# Altium project 8-8_控制板.PrjPCB
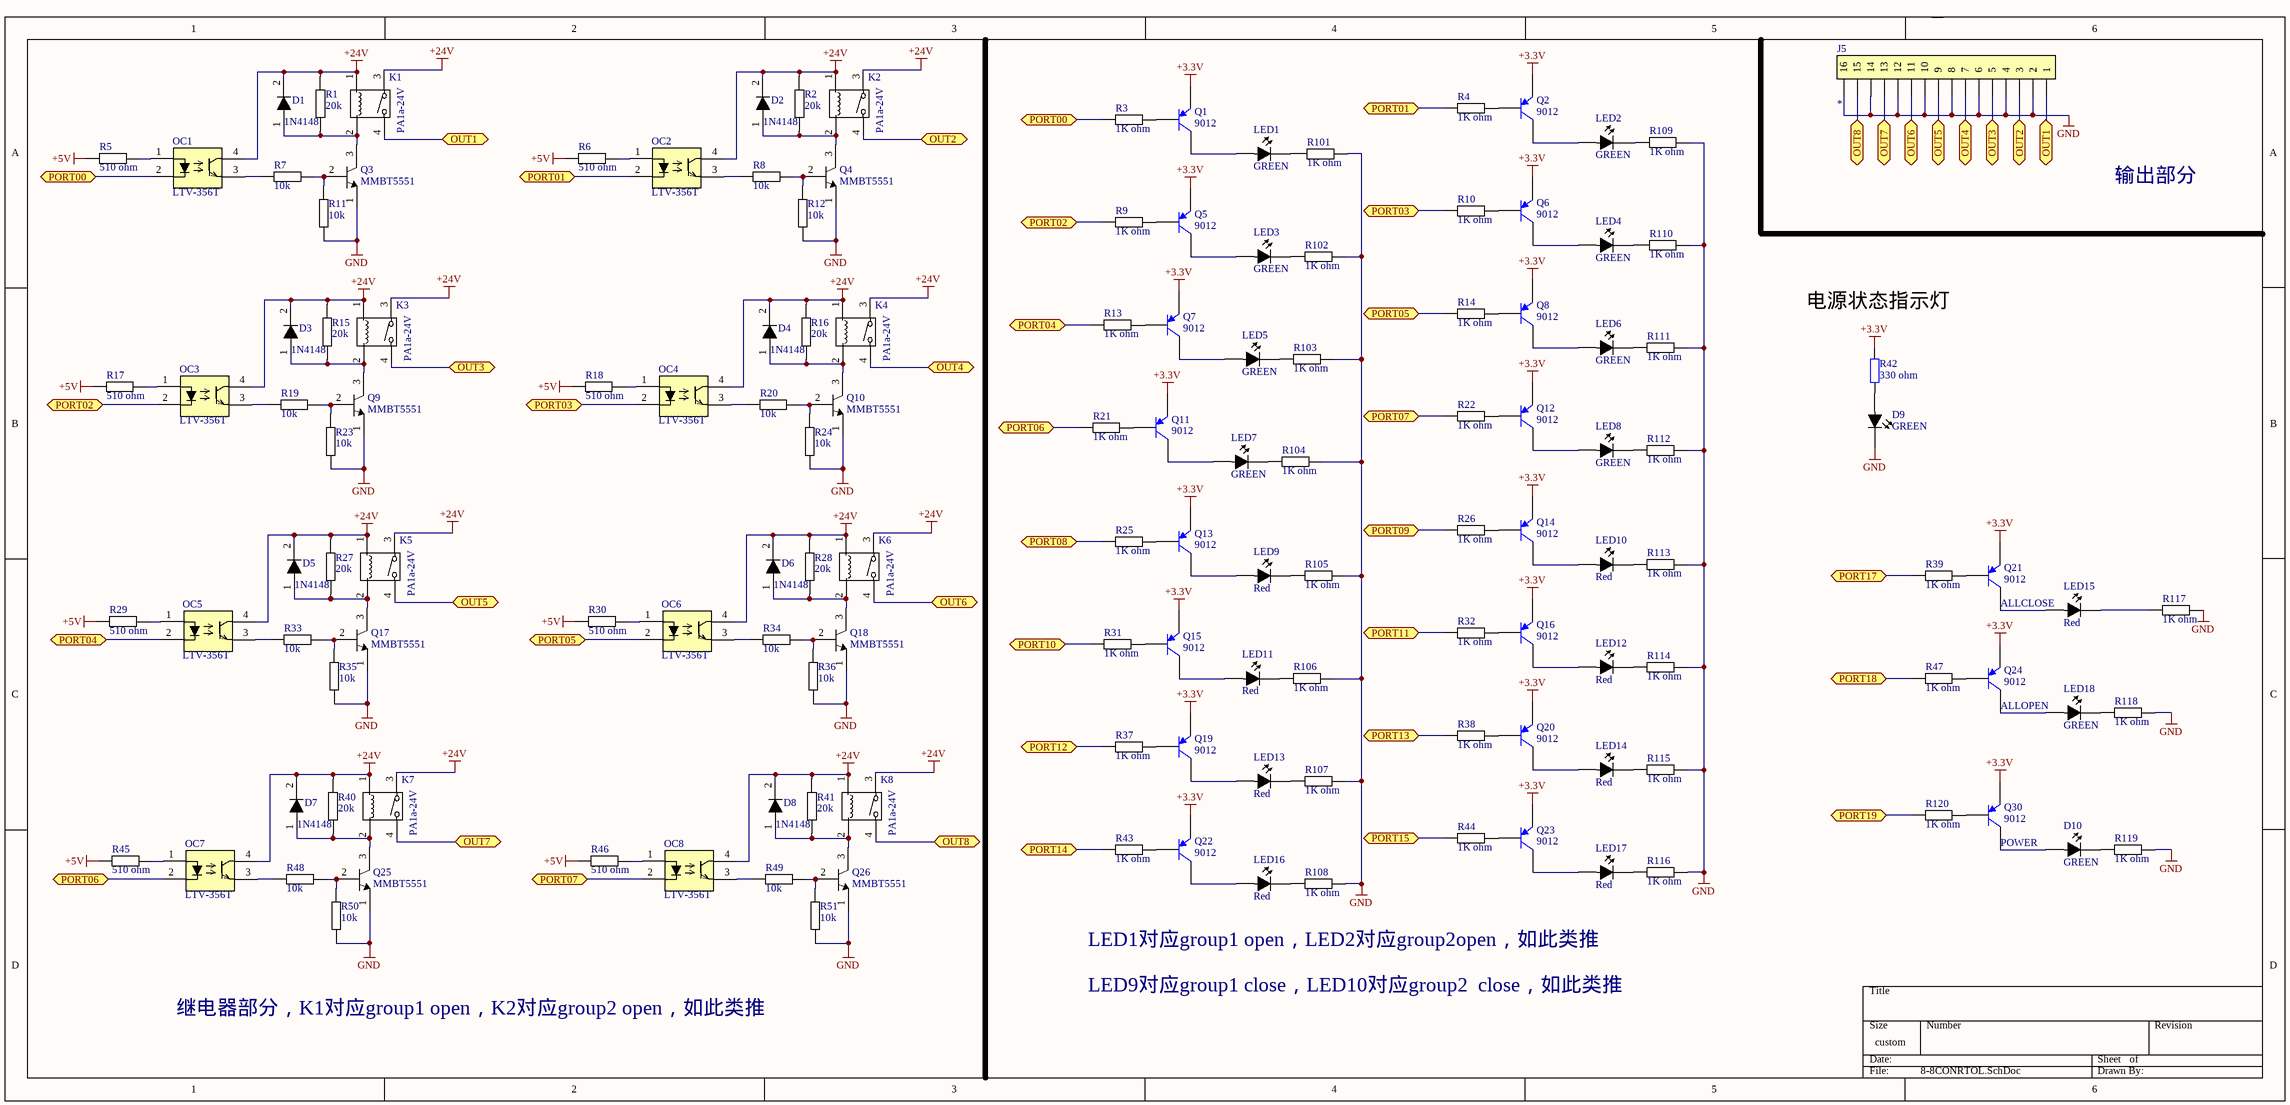
[diagram p0: 8-8CONRTOL.SchDoc]
2 sheets, 240 parts. Net scope: flat (ports and power ports of the same name join across sheets).
Board file: 8-8控制板.PcbDoc
Sheets:
  8-8CONRTOL.SchDoc
  8-8main.SchDoc

## Sheet 8-8CONRTOL.SchDoc
size 508 x 241 mm

### Parts
D1  1N4148  [D 1N4148(SOD-80/LL-34)]
D2  1N4148  [D 1N4148(SOD-80/LL-34)]
D3  1N4148  [D 1N4148(SOD-80/LL-34)]
D4  1N4148  [D 1N4148(SOD-80/LL-34)]
D5  1N4148  [D 1N4148(SOD-80/LL-34)]
D6  1N4148  [D 1N4148(SOD-80/LL-34)]
D7  1N4148  [D 1N4148(SOD-80/LL-34)]
D8  1N4148  [D 1N4148(SOD-80/LL-34)]
D9  GREEN  [0805 D]
D10  GREEN  [LED 3mm SIP]
J5  Header 1*16  [TIMECON5.1MMA]  (value not drawn)
K1  PA1a-24V  [Relay PA1a-24V]
K2  PA1a-24V  [Relay PA1a-24V]
K3  PA1a-24V  [Relay PA1a-24V]
K4  PA1a-24V  [Relay PA1a-24V]
K5  PA1a-24V  [Relay PA1a-24V]
K6  PA1a-24V  [Relay PA1a-24V]
K7  PA1a-24V  [Relay PA1a-24V]
K8  PA1a-24V  [Relay PA1a-24V]
LED1  GREEN  [LED 3mm SIP]
LED2  GREEN  [LED 3mm SIP]
LED3  GREEN  [LED 3mm SIP]
LED4  GREEN  [LED 3mm SIP]
LED5  GREEN  [LED 3mm SIP]
LED6  GREEN  [LED 3mm SIP]
LED7  GREEN  [LED 3mm SIP]
LED8  GREEN  [LED 3mm SIP]
LED9  Red  [LED 3mm SIP]
LED10  Red  [LED 3mm SIP]
LED11  Red  [LED 3mm SIP]
LED12  Red  [LED 3mm SIP]
LED13  Red  [LED 3mm SIP]
LED14  Red  [LED 3mm SIP]
LED15  Red  [LED 3mm SIP]
LED16  Red  [LED 3mm SIP]
LED17  Red  [LED 3mm SIP]
LED18  GREEN  [LED 3mm SIP]
OC1  LTV-356T  [SOP-4 LTV356T]
OC2  LTV-356T  [SOP-4 LTV356T]
OC3  LTV-356T  [SOP-4 LTV356T]
OC4  LTV-356T  [SOP-4 LTV356T]
OC5  LTV-356T  [SOP-4 LTV356T]
OC6  LTV-356T  [SOP-4 LTV356T]
OC7  LTV-356T  [SOP-4 LTV356T]
OC8  LTV-356T  [SOP-4 LTV356T]
Q1  9012  [9012  SOT-23/TO-236)]
Q2  9012  [9012  SOT-23/TO-236)]
Q3  MMBT5551  [MMBT5551(SOT-23/TO-236)]
Q4  MMBT5551  [MMBT5551(SOT-23/TO-236)]
Q5  9012  [9012  SOT-23/TO-236)]
Q6  9012  [9012  SOT-23/TO-236)]
Q7  9012  [9012  SOT-23/TO-236)]
Q8  9012  [9012  SOT-23/TO-236)]
Q9  MMBT5551  [MMBT5551(SOT-23/TO-236)]
Q10  MMBT5551  [MMBT5551(SOT-23/TO-236)]
Q11  9012  [9012  SOT-23/TO-236)]
Q12  9012  [9012  SOT-23/TO-236)]
Q13  9012  [9012  SOT-23/TO-236)]
Q14  9012  [9012  SOT-23/TO-236)]
Q15  9012  [9012  SOT-23/TO-236)]
Q16  9012  [9012  SOT-23/TO-236)]
Q17  MMBT5551  [MMBT5551(SOT-23/TO-236)]
Q18  MMBT5551  [MMBT5551(SOT-23/TO-236)]
Q19  9012  [9012  SOT-23/TO-236)]
Q20  9012  [9012  SOT-23/TO-236)]
Q21  9012  [9012  SOT-23/TO-236)]
Q22  9012  [9012  SOT-23/TO-236)]
Q23  9012  [9012  SOT-23/TO-236)]
Q24  9012  [9012  SOT-23/TO-236)]
Q25  MMBT5551  [MMBT5551(SOT-23/TO-236)]
Q26  MMBT5551  [MMBT5551(SOT-23/TO-236)]
Q30  9012  [9012  SOT-23/TO-236)]
R1  value 20k  [0805 R 1/8W]  (hidden comment: RES)
R2  value 20k  [0805 R 1/8W]  (hidden comment: RES)
R3  value 1K ohm  [0805 R 1/8W]  (hidden comment: RES)
R4  value 1K ohm  [0805 R 1/8W]  (hidden comment: RES)
R5  value 510 ohm  [0805 R 1/8W]  (hidden comment: RES)
R6  value 510 ohm  [0805 R 1/8W]  (hidden comment: RES)
R7  value 10k  [0805 R 1/8W]  (hidden comment: RES)
R8  value 10k  [0805 R 1/8W]  (hidden comment: RES)
R9  value 1K ohm  [0805 R 1/8W]  (hidden comment: RES)
R10  value 1K ohm  [0805 R 1/8W]  (hidden comment: RES)
R11  value 10k  [0805 R 1/8W]  (hidden comment: RES)
R12  value 10k  [0805 R 1/8W]  (hidden comment: RES)
R13  value 1K ohm  [0805 R 1/8W]  (hidden comment: RES)
R14  value 1K ohm  [0805 R 1/8W]  (hidden comment: RES)
R15  value 20k  [0805 R 1/8W]  (hidden comment: RES)
R16  value 20k  [0805 R 1/8W]  (hidden comment: RES)
R17  value 510 ohm  [0805 R 1/8W]  (hidden comment: RES)
R18  value 510 ohm  [0805 R 1/8W]  (hidden comment: RES)
R19  value 10k  [0805 R 1/8W]  (hidden comment: RES)
R20  value 10k  [0805 R 1/8W]  (hidden comment: RES)
R21  value 1K ohm  [0805 R 1/8W]  (hidden comment: RES)
R22  value 1K ohm  [0805 R 1/8W]  (hidden comment: RES)
R23  value 10k  [0805 R 1/8W]  (hidden comment: RES)
R24  value 10k  [0805 R 1/8W]  (hidden comment: RES)
R25  value 1K ohm  [0805 R 1/8W]  (hidden comment: RES)
R26  value 1K ohm  [0805 R 1/8W]  (hidden comment: RES)
R27  value 20k  [0805 R 1/8W]  (hidden comment: RES)
R28  value 20k  [0805 R 1/8W]  (hidden comment: RES)
R29  value 510 ohm  [0805 R 1/8W]  (hidden comment: RES)
R30  value 510 ohm  [0805 R 1/8W]  (hidden comment: RES)
R31  value 1K ohm  [0805 R 1/8W]  (hidden comment: RES)
R32  value 1K ohm  [0805 R 1/8W]  (hidden comment: RES)
R33  value 10k  [0805 R 1/8W]  (hidden comment: RES)
R34  value 10k  [0805 R 1/8W]  (hidden comment: RES)
R35  value 10k  [0805 R 1/8W]  (hidden comment: RES)
R36  value 10k  [0805 R 1/8W]  (hidden comment: RES)
R37  value 1K ohm  [0805 R 1/8W]  (hidden comment: RES)
R38  value 1K ohm  [0805 R 1/8W]  (hidden comment: RES)
R39  value 1K ohm  [0805 R 1/8W]  (hidden comment: RES)
R40  value 20k  [0805 R 1/8W]  (hidden comment: RES)
R41  value 20k  [0805 R 1/8W]  (hidden comment: RES)
R42  330 ohm  [0805 D]
R43  value 1K ohm  [0805 R 1/8W]  (hidden comment: RES)
R44  value 1K ohm  [0805 R 1/8W]  (hidden comment: RES)
R45  value 510 ohm  [0805 R 1/8W]  (hidden comment: RES)
R46  value 510 ohm  [0805 R 1/8W]  (hidden comment: RES)
R47  value 1K ohm  [0805 R 1/8W]  (hidden comment: RES)
R48  value 10k  [0805 R 1/8W]  (hidden comment: RES)
R49  value 10k  [0805 R 1/8W]  (hidden comment: RES)
R50  value 10k  [0805 R 1/8W]  (hidden comment: RES)
R51  value 10k  [0805 R 1/8W]  (hidden comment: RES)
R101  value 1K ohm  [0805 R 1/8W]  (hidden comment: RES)
R102  value 1K ohm  [0805 R 1/8W]  (hidden comment: RES)
R103  value 1K ohm  [0805 R 1/8W]  (hidden comment: RES)
R104  value 1K ohm  [0805 R 1/8W]  (hidden comment: RES)
R105  value 1K ohm  [0805 R 1/8W]  (hidden comment: RES)
R106  value 1K ohm  [0805 R 1/8W]  (hidden comment: RES)
R107  value 1K ohm  [0805 R 1/8W]  (hidden comment: RES)
R108  value 1K ohm  [0805 R 1/8W]  (hidden comment: RES)
R109  value 1K ohm  [0805 R 1/8W]  (hidden comment: RES)
R110  value 1K ohm  [0805 R 1/8W]  (hidden comment: RES)
R111  value 1K ohm  [0805 R 1/8W]  (hidden comment: RES)
R112  value 1K ohm  [0805 R 1/8W]  (hidden comment: RES)
R113  value 1K ohm  [0805 R 1/8W]  (hidden comment: RES)
R114  value 1K ohm  [0805 R 1/8W]  (hidden comment: RES)
R115  value 1K ohm  [0805 R 1/8W]  (hidden comment: RES)
R116  value 1K ohm  [0805 R 1/8W]  (hidden comment: RES)
R117  value 1K ohm  [0805 R 1/8W]  (hidden comment: RES)
R118  value 1K ohm  [0805 R 1/8W]  (hidden comment: RES)
R119  value 1K ohm  [0805 R 1/8W]  (hidden comment: RES)
R120  value 1K ohm  [0805 R 1/8W]  (hidden comment: RES)

### Ports
OUT1 (bidir), OUT2 (bidir), OUT3 (bidir), OUT4 (bidir), OUT5 (bidir), OUT6 (bidir), OUT7 (bidir), OUT8 (bidir), PORT00 (bidir), PORT01 (bidir), PORT02 (bidir), PORT03 (bidir), PORT04 (bidir), PORT05 (bidir), PORT06 (bidir), PORT07 (bidir), PORT08 (bidir), PORT09 (bidir), PORT10 (bidir), PORT11 (bidir), PORT12 (bidir), PORT13 (bidir), PORT14 (bidir), PORT15 (bidir), PORT17 (bidir), PORT18 (bidir), PORT19 (bidir)

### Nets
+3.3V: Q1.2(E) Q2.2(E) Q5.2(E) Q6.2(E) Q7.2(E) Q8.2(E) Q11.2(E) Q12.2(E) Q13.2(E) Q14.2(E) Q15.2(E) Q16.2(E) Q19.2(E) Q20.2(E) Q21.2(E) Q22.2(E) Q23.2(E) Q24.2(E) Q30.2(E) R42.2
+5V: R5.1 R6.1 R17.1 R18.1 R29.1 R30.1 R45.1 R46.1
+24V: D1.2(K) D2.2(K) D3.2(K) D4.2(K) D5.2(K) D6.2(K) D7.2(K) D8.2(K) K1.1 K1.3 K2.1 K2.3 K3.1 K3.3 K4.1 K4.3 K5.1 K5.3 K6.1 K6.3 K7.1 K7.3 K8.1 K8.3 OC1.4 OC2.4 OC3.4 OC4.4 OC5.4 OC6.4 OC7.4 OC8.4 R1.2 R2.2 R15.2 R16.2 R27.2 R28.2 R40.2 R41.2
GND: D9.2(K) J5.2 J5.4 J5.6 J5.8 J5.10 J5.12 J5.14 J5.16 Q3.1(E) Q4.1(E) Q9.1(E) Q10.1(E) Q17.1(E) Q18.1(E) Q25.1(E) Q26.1(E) R11.1 R12.1 R23.1 R24.1 R35.1 R36.1 R50.1 R51.1 R101.2 R102.2 R103.2 R104.2 R105.2 R106.2 R107.2 R108.2 R109.2 R110.2 R111.2 R112.2 R113.2 R114.2 R115.2 R116.2 R117.2 R118.2 R119.2
NetD1_1: D1.1(A) K1.2 Q3.3(C) R1.1
NetD2_1: D2.1(A) K2.2 Q4.3(C) R2.1
NetD3_1: D3.1(A) K3.2 Q9.3(C) R15.1
NetD4_1: D4.1(A) K4.2 Q10.3(C) R16.1
NetD5_1: D5.1(A) K5.2 Q17.3(C) R27.1
NetD6_1: D6.1(A) K6.2 Q18.3(C) R28.1
NetD7_1: D7.1(A) K7.2 Q25.3(C) R40.1
NetD8_1: D8.1(A) K8.2 Q26.3(C) R41.1
NetD9_1: D9.1(A) R42.1
NetD10_1: D10.1(A) Q30.3(C)
NetD10_2: D10.2(K) R119.1
NetJ5_1: J5.1 K1.4 ; port OUT1
NetJ5_3: J5.3 K2.4 ; port OUT2
NetJ5_5: J5.5 K3.4 ; port OUT3
NetJ5_7: J5.7 K4.4 ; port OUT4
NetJ5_9: J5.9 K5.4 ; port OUT5
NetJ5_11: J5.11 K6.4 ; port OUT6
NetJ5_13: J5.13 K7.4 ; port OUT7
NetJ5_15: J5.15 K8.4 ; port OUT8
NetLED1_1: LED1.1(A) Q1.3(C)
NetLED1_2: LED1.2(K) R101.1
NetLED2_1: LED2.1(A) Q2.3(C)
NetLED2_2: LED2.2(K) R109.1
NetLED3_1: LED3.1(A) Q5.3(C)
NetLED3_2: LED3.2(K) R102.1
NetLED4_1: LED4.1(A) Q6.3(C)
NetLED4_2: LED4.2(K) R110.1
NetLED5_1: LED5.1(A) Q7.3(C)
NetLED5_2: LED5.2(K) R103.1
NetLED6_1: LED6.1(A) Q8.3(C)
NetLED6_2: LED6.2(K) R111.1
NetLED7_1: LED7.1(A) Q11.3(C)
NetLED7_2: LED7.2(K) R104.1
NetLED8_1: LED8.1(A) Q12.3(C)
NetLED8_2: LED8.2(K) R112.1
NetLED9_1: LED9.1(A) Q13.3(C)
NetLED9_2: LED9.2(K) R105.1
NetLED10_1: LED10.1(A) Q14.3(C)
NetLED10_2: LED10.2(K) R113.1
NetLED11_1: LED11.1(A) Q15.3(C)
NetLED11_2: LED11.2(K) R106.1
NetLED12_1: LED12.1(A) Q16.3(C)
NetLED12_2: LED12.2(K) R114.1
NetLED13_1: LED13.1(A) Q19.3(C)
NetLED13_2: LED13.2(K) R107.1
NetLED14_1: LED14.1(A) Q20.3(C)
NetLED14_2: LED14.2(K) R115.1
NetLED15_1: LED15.1(A) Q21.3(C)
NetLED15_2: LED15.2(K) R117.1
NetLED16_1: LED16.1(A) Q22.3(C)
NetLED16_2: LED16.2(K) R108.1
NetLED17_1: LED17.1(A) Q23.3(C)
NetLED17_2: LED17.2(K) R116.1
NetLED18_1: LED18.1(A) Q24.3(C)
NetLED18_2: LED18.2(K) R118.1
NetOC1_1: OC1.1 R5.2
NetOC1_2: OC1.2 R3.1 ; port PORT00
NetOC1_3: OC1.3 R7.1
NetOC2_1: OC2.1 R6.2
NetOC2_2: OC2.2 R4.1 ; port PORT01
NetOC2_3: OC2.3 R8.1
NetOC3_1: OC3.1 R17.2
NetOC3_2: OC3.2 R9.1 ; port PORT02
NetOC3_3: OC3.3 R19.1
NetOC4_1: OC4.1 R18.2
NetOC4_2: OC4.2 R10.1 ; port PORT03
NetOC4_3: OC4.3 R20.1
NetOC5_1: OC5.1 R29.2
NetOC5_2: OC5.2 R13.1 ; port PORT04
NetOC5_3: OC5.3 R33.1
NetOC6_1: OC6.1 R30.2
NetOC6_2: OC6.2 R14.1 ; port PORT05
NetOC6_3: OC6.3 R34.1
NetOC7_1: OC7.1 R45.2
NetOC7_2: OC7.2 R21.1 ; port PORT06
NetOC7_3: OC7.3 R48.1
NetOC8_1: OC8.1 R46.2
NetOC8_2: OC8.2 R22.1 ; port PORT07
NetOC8_3: OC8.3 R49.1
NetQ1_1: Q1.1(B) R3.2
NetQ2_1: Q2.1(B) R4.2
NetQ3_2: Q3.2(B) R7.2 R11.2
NetQ4_2: Q4.2(B) R8.2 R12.2
NetQ5_1: Q5.1(B) R9.2
NetQ6_1: Q6.1(B) R10.2
NetQ7_1: Q7.1(B) R13.2
NetQ8_1: Q8.1(B) R14.2
NetQ9_2: Q9.2(B) R19.2 R23.2
NetQ10_2: Q10.2(B) R20.2 R24.2
NetQ11_1: Q11.1(B) R21.2
NetQ12_1: Q12.1(B) R22.2
NetQ13_1: Q13.1(B) R25.2
NetQ14_1: Q14.1(B) R26.2
NetQ15_1: Q15.1(B) R31.2
NetQ16_1: Q16.1(B) R32.2
NetQ17_2: Q17.2(B) R33.2 R35.2
NetQ18_2: Q18.2(B) R34.2 R36.2
NetQ19_1: Q19.1(B) R37.2
NetQ20_1: Q20.1(B) R38.2
NetQ21_1: Q21.1(B) R39.2
NetQ22_1: Q22.1(B) R43.2
NetQ23_1: Q23.1(B) R44.2
NetQ24_1: Q24.1(B) R47.2
NetQ25_2: Q25.2(B) R48.2 R50.2
NetQ26_2: Q26.2(B) R49.2 R51.2
NetQ30_1: Q30.1(B) R120.2
NetR25_1: R25.1 ; port PORT08
NetR26_1: R26.1 ; port PORT09
NetR31_1: R31.1 ; port PORT10
NetR32_1: R32.1 ; port PORT11
NetR37_1: R37.1 ; port PORT12
NetR38_1: R38.1 ; port PORT13
NetR39_1: R39.1 ; port PORT17
NetR43_1: R43.1 ; port PORT14
NetR44_1: R44.1 ; port PORT15
NetR47_1: R47.1 ; port PORT18
NetR120_1: R120.1 ; port PORT19

### Notes on the sheet
- 输出部分
- 电源状态指示灯
- (near Q21) ALLCLOSE
- (near Q24) ALLOPEN
- (near Q30) POWER
- LED1对应group1 open，LED2对应group2open，如此类推
- LED9对应group1 close，LED10对应group2  close，如此类推
- 继电器部分，K1对应group1 open，K2对应group2 open，如此类推

### Library data of the parts
D1-D8 = Diode
D9 D10 LED1-LED18 = LED
K1-K8 = Relay
OC1-OC8 = Opto1
Q1 Q2 Q5-Q8 Q11-Q16 Q19-Q24 Q30 = PNP: PNP Bipolar Transistor; Published: 8-Jun-2000; LatestRevisionDate: 29-May-2009; LatestRevisionNote: IPC-7351 Footprint Added.; PackageVersion: Aug-1999; PackageReference: SOT-23B; Publisher: Altium Limited; PackageDescription: 3-Pin SOT-23 Package 0.95 mm Pitch, 2.4 mm Lead Span
Q3 Q4 Q9 Q10 Q17 Q18 Q25 Q26 = NPN
R42 = Res2: Resistor; Value: 103; Published: 8-Jun-2000; LatestRevisionDate: 17-Jul-2002; LatestRevisionNote: Re-released for DXP Platform.; PackageReference: AXIAL-0.4; Publisher: Altium Limited
J5 = Header 1*16: Pin: *

## Sheet 8-8main.SchDoc
size 381 x 241 mm
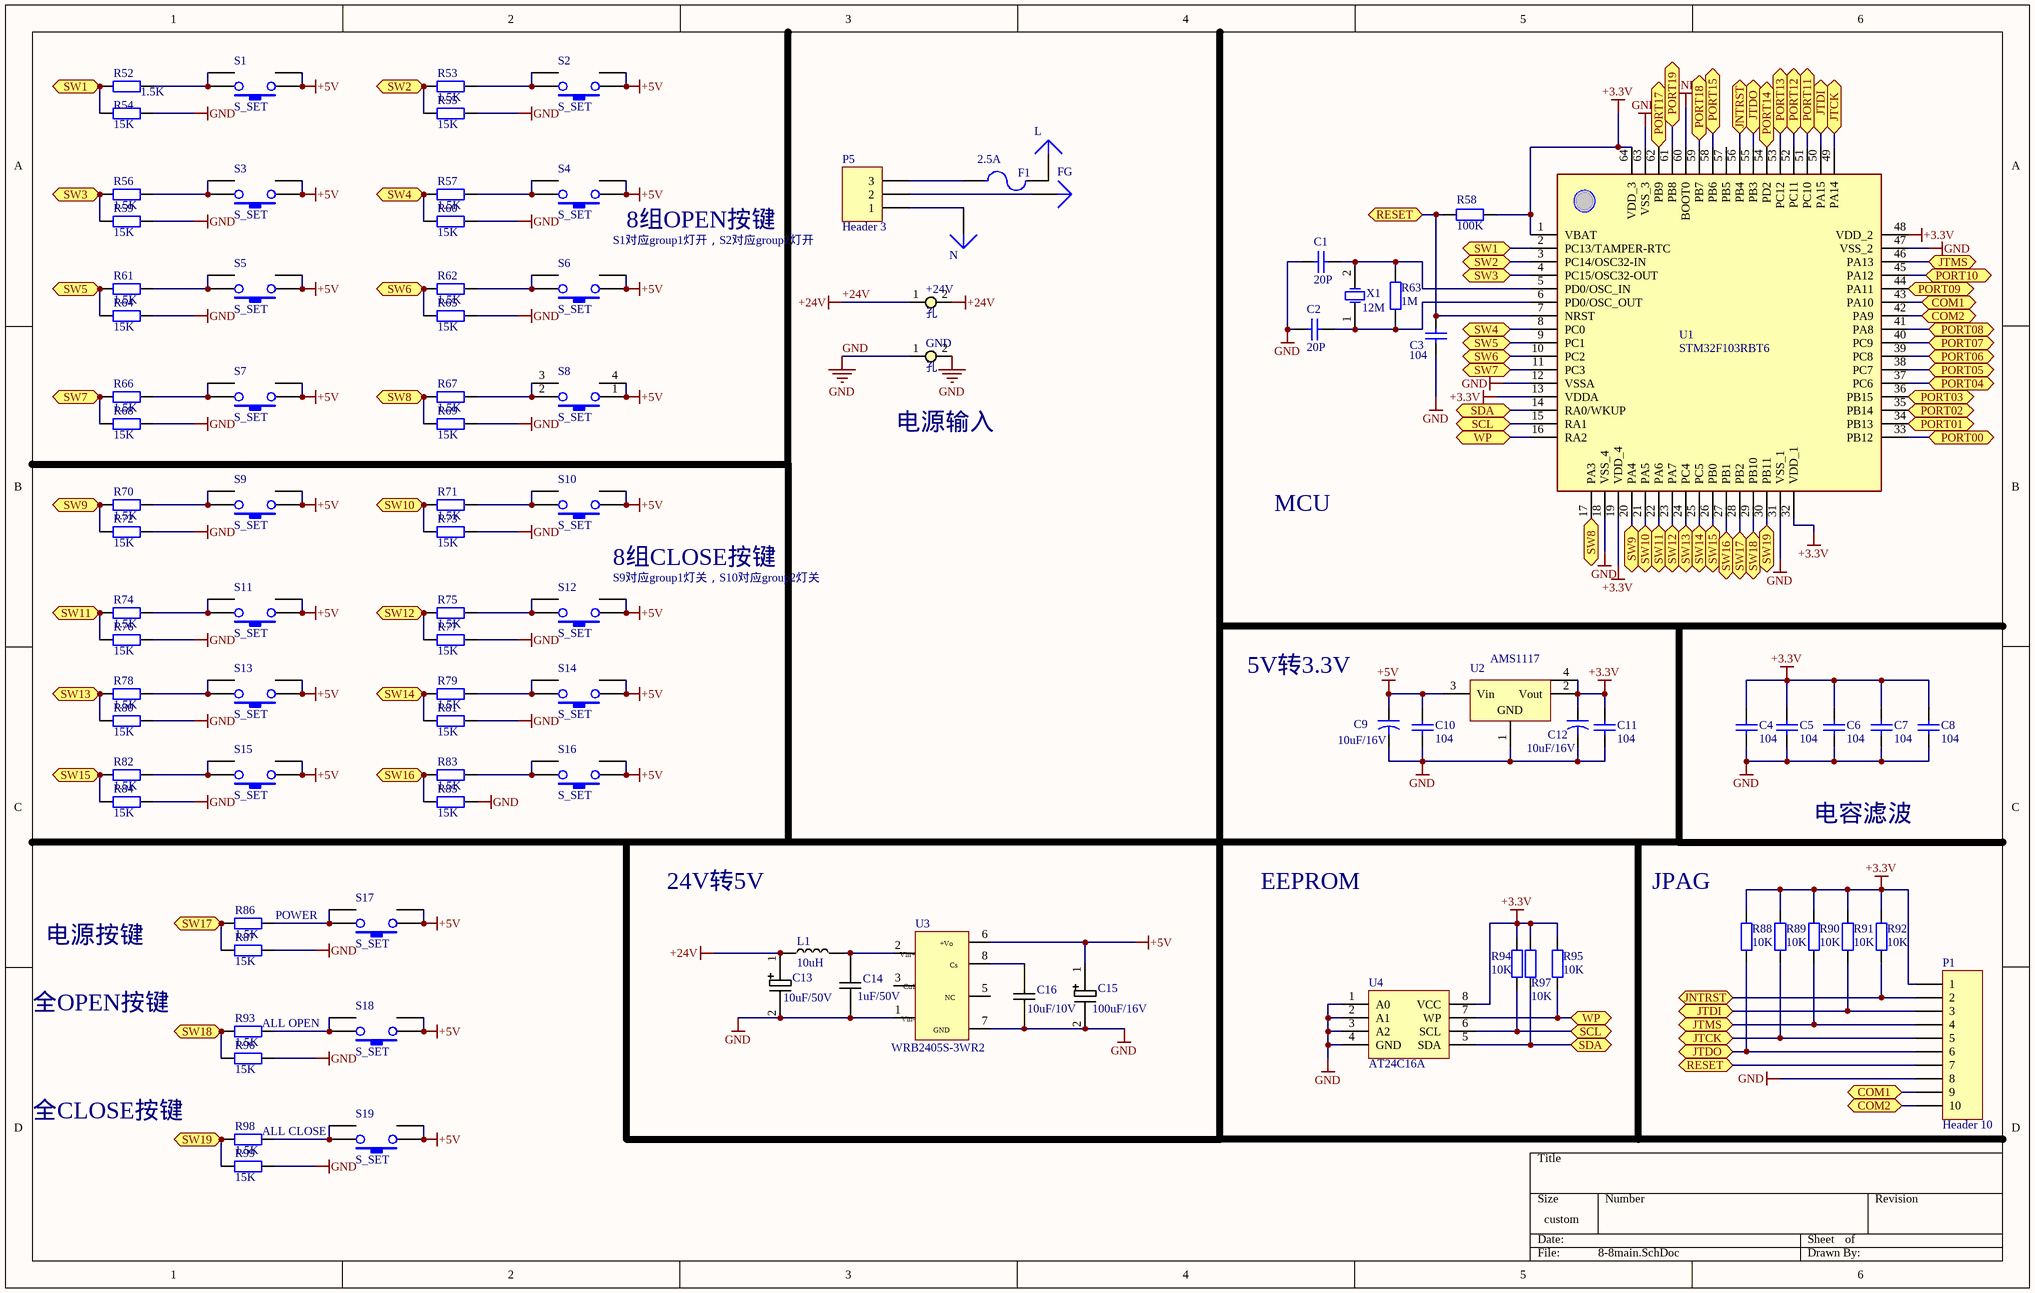
[diagram p1: 8-8main.SchDoc]

### Parts
+24V  孔  [TIMECON2PIN5.1MMA]
C1  value 20P  [0805 C]  (hidden comment: Cap)
C2  value 20P  [0805 C]  (hidden comment: Cap)
C3  value 104  [0805 C]  (hidden comment: Cap)
C4  value 104  [0603 C]  (hidden comment: Cap)
C5  value 104  [0603 C]  (hidden comment: Cap)
C6  value 104  [0603 C]  (hidden comment: Cap)
C7  value 104  [0603 C]  (hidden comment: Cap)
C8  value 104  [0603 C]  (hidden comment: Cap)
C9  value 10uF/16V  [0805 C]
C10  value 104  [0805 C]  (hidden comment: Cap)
C11  value 104  [0805 C]  (hidden comment: Cap)
C12  value 10uF/16V  [0805 C]
C13  value 10uF/50V  [C 10uF/50V]  (hidden comment: CAP Al)
C14  value 1uF/50V  [0805 C]  (hidden comment: CAP)
C15  value 100uF/16V  [C 100uF/16V φ5*11mm SIP]  (hidden comment: CAP Al)
C16  value 10uF/10V  [0805 C]  (hidden comment: CAP)
F1  2.5A  [1A/250V-1]
FG  (no value)  [VIA]
GND  孔  [TIMECON2PIN5.1MMA]
L  (no value)  [VIA]
L1  value 10uH  [L 2.2uH SMD]  (hidden comment: Inductor)
N  (no value)  [VIA]
P1  Header 10  [Header 2*5 SMD]
P5  Header 3  [TIMECON3PIN5.1MMA]
R52  value 1.5K  [0805 R 1/8W]  (hidden comment: Res2)
R53  value 1.5K  [0805 R 1/8W]  (hidden comment: Res2)
R54  value 15K  [0805 R 1/8W]  (hidden comment: Res2)
R55  value 15K  [0805 R 1/8W]  (hidden comment: Res2)
R56  value 1.5K  [0805 R 1/8W]  (hidden comment: Res2)
R57  value 1.5K  [0805 R 1/8W]  (hidden comment: Res2)
R58  value 100K  [0805 R 1/8W]  (hidden comment: Res2)
R59  value 15K  [0805 R 1/8W]  (hidden comment: Res2)
R60  value 15K  [0805 R 1/8W]  (hidden comment: Res2)
R61  value 1.5K  [0805 R 1/8W]  (hidden comment: Res2)
R62  value 1.5K  [0805 R 1/8W]  (hidden comment: Res2)
R63  value 1M  [0805 R 1/8W]  (hidden comment: Res2)
R64  value 15K  [0805 R 1/8W]  (hidden comment: Res2)
R65  value 15K  [0805 R 1/8W]  (hidden comment: Res2)
R66  value 1.5K  [0805 R 1/8W]  (hidden comment: Res2)
R67  value 1.5K  [0805 R 1/8W]  (hidden comment: Res2)
R68  value 15K  [0805 R 1/8W]  (hidden comment: Res2)
R69  value 15K  [0805 R 1/8W]  (hidden comment: Res2)
R70  value 1.5K  [0805 R 1/8W]  (hidden comment: Res2)
R71  value 1.5K  [0805 R 1/8W]  (hidden comment: Res2)
R72  value 15K  [0805 R 1/8W]  (hidden comment: Res2)
R73  value 15K  [0805 R 1/8W]  (hidden comment: Res2)
R74  value 1.5K  [0805 R 1/8W]  (hidden comment: Res2)
R75  value 1.5K  [0805 R 1/8W]  (hidden comment: Res2)
R76  value 15K  [0805 R 1/8W]  (hidden comment: Res2)
R77  value 15K  [0805 R 1/8W]  (hidden comment: Res2)
R78  value 1.5K  [0805 R 1/8W]  (hidden comment: Res2)
R79  value 1.5K  [0805 R 1/8W]  (hidden comment: Res2)
R80  value 15K  [0805 R 1/8W]  (hidden comment: Res2)
R81  value 15K  [0805 R 1/8W]  (hidden comment: Res2)
R82  value 1.5K  [0805 R 1/8W]  (hidden comment: Res2)
R83  value 1.5K  [0805 R 1/8W]  (hidden comment: Res2)
R84  value 15K  [0805 R 1/8W]  (hidden comment: Res2)
R85  value 15K  [0805 R 1/8W]  (hidden comment: Res2)
R86  value 1.5K  [0805 R 1/8W]  (hidden comment: Res2)
R87  value 15K  [0805 R 1/8W]  (hidden comment: Res2)
R88  value 10K  [0805 R 1/8W]  (hidden comment: Res2)
R89  value 10K  [0805 R 1/8W]  (hidden comment: Res2)
R90  value 10K  [0805 R 1/8W]  (hidden comment: Res2)
R91  value 10K  [0805 R 1/8W]  (hidden comment: Res2)
R92  value 10K  [0805 R 1/8W]  (hidden comment: Res2)
R93  value 1.5K  [0805 R 1/8W]  (hidden comment: Res2)
R94  value 10K  [0805 R 1/8W]  (hidden comment: Res2)
R95  value 10K  [0805 R 1/8W]  (hidden comment: Res2)
R96  value 15K  [0805 R 1/8W]  (hidden comment: Res2)
R97  value 10K  [0805 R 1/8W]  (hidden comment: Res2)
R98  value 1.5K  [0805 R 1/8W]  (hidden comment: Res2)
R99  value 15K  [0805 R 1/8W]  (hidden comment: Res2)
S1  S_SET  [12*12*4.3]
S2  S_SET  [12*12*4.3]
S3  S_SET  [12*12*4.3]
S4  S_SET  [12*12*4.3]
S5  S_SET  [12*12*4.3]
S6  S_SET  [12*12*4.3]
S7  S_SET  [12*12*4.3]
S8  S_SET  [12*12*4.3]
S9  S_SET  [12*12*4.3]
S10  S_SET  [12*12*4.3]
S11  S_SET  [12*12*4.3]
S12  S_SET  [12*12*4.3]
S13  S_SET  [12*12*4.3]
S14  S_SET  [12*12*4.3]
S15  S_SET  [12*12*4.3]
S16  S_SET  [12*12*4.3]
S17  S_SET  [12*12*4.3]
S18  S_SET  [12*12*4.3]
S19  S_SET  [12*12*4.3]
U1  STM32F103RBT6  [STM32F103RBT6]
U2  AMS1117  [SOT223_L]
U3  WRB2405S-3WR2  [WRB_S-3WR2]
U4  AT24C16A  [SOIC]
X1  12M  [XTAL SMD]

### Ports
COM1, COM2, JNTRST (bidir), JTCK (bidir), JTDI (bidir), JTDO (bidir), JTMS (bidir), PORT00 (bidir), PORT01 (bidir), PORT02 (bidir), PORT03 (bidir), PORT04 (bidir), PORT05 (bidir), PORT06 (bidir), PORT07 (bidir), PORT08 (bidir), PORT09 (bidir), PORT10 (bidir), PORT11 (bidir), PORT12 (bidir), PORT13 (bidir), PORT14 (bidir), PORT15 (bidir), PORT17 (bidir), PORT18 (bidir), PORT19 (bidir), RESET (bidir), SCL (bidir), SDA (bidir), SW1 (bidir), SW2 (bidir), SW3 (bidir), SW4 (bidir), SW5 (bidir), SW6 (bidir), SW7 (bidir), SW8 (bidir), SW9 (bidir), SW10 (bidir), SW11 (bidir), SW12 (bidir), SW13 (bidir), SW14 (bidir), SW15 (bidir), SW16 (bidir), SW17 (bidir), SW18 (bidir), SW19 (bidir), WP (bidir)

### Nets
+3.3V: C4.1 C5.1 C6.1 C7.1 C8.1 C11.1 C12.1 P1.1 R58.2 R88.2 R89.2 R90.2 R91.2 R92.2 R94.2 R95.2 R97.2 U1.1(VBAT) U1.13(VDDA) U1.19(VDD_4) U1.32(VDD_1) U1.48(VDD_2) U1.64(VDD_3) U2.2(Vout) U2.4(Vout) U4.8(VCC)
+5V: C9.1 C10.1 C15.1 S1.1 S1.4 S2.1 S2.4 S3.1 S3.4 S4.1 S4.4 S5.1 S5.4 S6.1 S6.4 S7.1 S7.4 S8.1 S8.4 S9.1 S9.4 S10.1 S10.4 S11.1 S11.4 S12.1 S12.4 S13.1 S13.4 S14.1 S14.4 S15.1 S15.4 S16.1 S16.4 S17.1 S17.4 S18.1 S18.4 S19.1 S19.4 U2.3(Vin) U3.6
+24V: +24V.1 +24V.2 C13.1 L1.1
GND: C1.2 C2.2 C3.1 C4.2 C5.2 C6.2 C7.2 C8.2 C9.2 C10.2 C11.2 C12.2 C13.2 C14.1 C15.2 C16.1 GND.1 GND.2 P1.8 R54.1 R55.1 R59.1 R60.1 R64.1 R65.1 R68.1 R69.1 R72.1 R73.1 R76.1 R77.1 R80.1 R81.1 R84.1 R85.1 R87.1 R96.1 R99.1 U1.12(VSSA) U1.18(VSS_4) U1.31(VSS_1) U1.47(VSS_2) U1.60(BOOT0) U1.63(VSS_3) U2.1(GND) U3.1 U3.7 U4.1(A0) U4.2(A1) U4.3(A2) U4.4(GND)
NetC1_1: C1.1 R63.1 U1.5(PD0/OSC_IN) X1.2(OSC2)
NetC2_1: C2.1 R63.2 U1.6(PD0/OSC_OUT) X1.1(OSC1)
NetC3_2: C3.2 P1.7 R58.1 U1.7(NRST) ; port RESET
NetC14_2: C14.2 L1.2 U3.2
NetC16_2: C16.2 U3.8
NetF1_1: F1.1 P5.3
NetF1_2: F1.2 L.1
NetFG_1: FG.1 P5.2
NetN_1: N.1 P5.1
NetOC1_2: U1.33(PB12) ; port PORT00
NetOC2_2: U1.34(PB13) ; port PORT01
NetOC3_2: U1.35(PB14) ; port PORT02
NetOC4_2: U1.36(PB15) ; port PORT03
NetOC5_2: U1.37(PC6) ; port PORT04
NetOC6_2: U1.38(PC7) ; port PORT05
NetOC7_2: U1.39(PC8) ; port PORT06
NetOC8_2: U1.40(PC9) ; port PORT07
NetP1_2: P1.2 R92.1 U1.56(PB4) ; port JNTRST
NetP1_3: P1.3 R91.1 U1.50(PA15) ; port JTDI
NetP1_4: P1.4 R90.1 U1.46(PA13) ; port JTMS
NetP1_5: P1.5 R89.1 U1.49(PA14) ; port JTCK
NetP1_6: P1.6 R88.1 U1.55(PB3) ; port JTDO
NetP1_9: P1.9 U1.43(PA10) ; port COM1
NetP1_10: P1.10 U1.42(PA9) ; port COM2
NetR25_1: U1.41(PA8) ; port PORT08
NetR26_1: U1.44(PA11) ; port PORT09
NetR31_1: U1.45(PA12) ; port PORT10
NetR32_1: U1.51(PC10) ; port PORT11
NetR37_1: U1.52(PC11) ; port PORT12
NetR38_1: U1.53(PC12) ; port PORT13
NetR39_1: U1.62(PB9) ; port PORT17
NetR43_1: U1.54(PD2) ; port PORT14
NetR44_1: U1.58(PB6) ; port PORT15
NetR47_1: U1.59(PB7) ; port PORT18
NetR52_1: R52.1 S1.2 S1.3
NetR52_2: R52.2 R54.2 U1.2(PC13/TAMPER-RTC) ; port SW1
NetR53_1: R53.1 S2.2 S2.3
NetR53_2: R53.2 R55.2 U1.3(PC14/OSC32-IN) ; port SW2
NetR56_1: R56.1 S3.2 S3.3
NetR56_2: R56.2 R59.2 U1.4(PC15/OSC32-OUT) ; port SW3
NetR57_1: R57.1 S4.2 S4.3
NetR57_2: R57.2 R60.2 U1.8(PC0) ; port SW4
NetR61_1: R61.1 S5.2 S5.3
NetR61_2: R61.2 R64.2 U1.9(PC1) ; port SW5
NetR62_1: R62.1 S6.2 S6.3
NetR62_2: R62.2 R65.2 U1.10(PC2) ; port SW6
NetR66_1: R66.1 S7.2 S7.3
NetR66_2: R66.2 R68.2 U1.11(PC3) ; port SW7
NetR67_1: R67.1 S8.2 S8.3
NetR67_2: R67.2 R69.2 U1.17(PA3) ; port SW8
NetR70_1: R70.1 S9.2 S9.3
NetR70_2: R70.2 R72.2 U1.20(PA4) ; port SW9
NetR71_1: R71.1 S10.2 S10.3
NetR71_2: R71.2 R73.2 U1.21(PA5) ; port SW10
NetR74_1: R74.1 S11.2 S11.3
NetR74_2: R74.2 R76.2 U1.22(PA6) ; port SW11
NetR75_1: R75.1 S12.2 S12.3
NetR75_2: R75.2 R77.2 U1.23(PA7) ; port SW12
NetR78_1: R78.1 S13.2 S13.3
NetR78_2: R78.2 R80.2 U1.24(PC4) ; port SW13
NetR79_1: R79.1 S14.2 S14.3
NetR79_2: R79.2 R81.2 U1.25(PC5) ; port SW14
NetR82_1: R82.1 S15.2 S15.3
NetR82_2: R82.2 R84.2 U1.26(PB0) ; port SW15
NetR83_1: R83.1 S16.2 S16.3
NetR83_2: R83.2 R85.2 U1.27(PB1) ; port SW16
NetR86_1: R86.1 S17.2 S17.3
NetR86_2: R86.2 R87.2 U1.28(PB2) ; port SW17
NetR93_1: R93.1 S18.2 S18.3
NetR93_2: R93.2 R96.2 U1.29(PB10) ; port SW18
NetR94_1: R94.1 U1.15(RA1) U4.6(SCL) ; port SCL
NetR95_1: R95.1 U1.16(RA2) U4.7(WP) ; port WP
NetR97_1: R97.1 U1.14(RA0/WKUP) U4.5(SDA) ; port SDA
NetR98_1: R98.1 S19.2 S19.3
NetR98_2: R98.2 R99.2 U1.30(PB11) ; port SW19
NetR120_1: U1.61(PB8) ; port PORT19

Not connected (* = marked no-connect by the designer): U1 57(PB5); U3 3 5

### Notes on the sheet
- 8组OPEN按键
- S1对应group1灯开，S2对应group2灯开
- 电源输入
- 8组CLOSE按键
- MCU
- (near S12) S9对应group1灯关，S10对应group2灯关
- 5V转3.3V
- 电容滤波
- 24V转5V
- EEPROM
- (near R88) JPAG
- 电源按键
- (near R86) POWER
- 全OPEN按键
- (near R93) ALL OPEN
- 全CLOSE按键
- (near R98) ALL CLOSE
- (in symbol WRB2405S-3WR2) +Vo; Vin+; Cs; Ctrl; NC; Vin-; GND

### Library data of the parts
+24V GND = 安装孔3
C1-C8 C10 C11 = Cap: Capacitor; Manufacturer: Generic Components; Class: Passive; Published: 08/06/2000; Publisher: Altium Hobart Technology Centre; SubClass: Capacitor
C9 C12 = Cap2: Capacitor; Published: 23-Sep-2002; PackageReference: CAPR5-4X5; Publisher: Altium Limited
F1 = Fuse 2: Fuse; Published: 8-Jun-2000; LatestRevisionDate: 17-Jul-2002; LatestRevisionNote: Re-released for DXP Platform.; PackageReference: PIN-W2/E2.8; Publisher: Altium Limited
FG L N = PLUG
P1 = Header 10: Header, 10-Pin; LatestRevisionDate: 17-Jul-2002; LatestRevisionNote: Re-released for DXP Platform.; Publisher: Altium Limited
P5 = Header 3: Header, 3-Pin; LatestRevisionDate: 17-Jul-2002; LatestRevisionNote: Re-released for DXP Platform.; Publisher: Altium Limited
R52-R99 = Res2: Resistor; Manufacturer: Generic Components; Class: Passive; Published: 08/06/2000; Publisher: Altium Hobart Technology Centre; SubClass: Resistor
S1-S19 = SW-PB
U1 = STM32F103R8T6
U2 = Volt Reg: Voltage Regulator; Published: 24-Mar-1999; LatestRevisionDate: 29-May-2009; LatestRevisionNote: IPC-7351 Footprint Added.; PackageReference: D2PAK; Publisher: Altium Limited; PackageDescription: 3-Pin Transistor Outline Package 2.54 mm Pitch, 15.1 mm Lead Span
X1 = XTAL: Crystal Oscillator; Manufacturer: Generic Components; Published: 08/06/2000; Publisher: Altium Hobart Technology Centre; Class: Oscillator; SubClass: Crystal Oscillator

## Nets that join several sheets
+3.3V: 8-8CONRTOL (20 pins), 8-8main (26 pins)
+5V: 8-8CONRTOL (8 pins), 8-8main (43 pins)
+24V: 8-8CONRTOL (40 pins), 8-8main (+24V.1 +24V.2 C13.1 L1.1)
GND: 8-8CONRTOL (44 pins), 8-8main (51 pins)
NetOC1_2: 8-8CONRTOL (OC1.2 R3.1), 8-8main (U1.33)
NetOC2_2: 8-8CONRTOL (OC2.2 R4.1), 8-8main (U1.34)
NetOC3_2: 8-8CONRTOL (OC3.2 R9.1), 8-8main (U1.35)
NetOC4_2: 8-8CONRTOL (OC4.2 R10.1), 8-8main (U1.36)
NetOC5_2: 8-8CONRTOL (OC5.2 R13.1), 8-8main (U1.37)
NetOC6_2: 8-8CONRTOL (OC6.2 R14.1), 8-8main (U1.38)
NetOC7_2: 8-8CONRTOL (OC7.2 R21.1), 8-8main (U1.39)
NetOC8_2: 8-8CONRTOL (OC8.2 R22.1), 8-8main (U1.40)
NetR25_1: 8-8CONRTOL (R25.1), 8-8main (U1.41)
NetR26_1: 8-8CONRTOL (R26.1), 8-8main (U1.44)
NetR31_1: 8-8CONRTOL (R31.1), 8-8main (U1.45)
NetR32_1: 8-8CONRTOL (R32.1), 8-8main (U1.51)
NetR37_1: 8-8CONRTOL (R37.1), 8-8main (U1.52)
NetR38_1: 8-8CONRTOL (R38.1), 8-8main (U1.53)
NetR39_1: 8-8CONRTOL (R39.1), 8-8main (U1.62)
NetR43_1: 8-8CONRTOL (R43.1), 8-8main (U1.54)
NetR44_1: 8-8CONRTOL (R44.1), 8-8main (U1.58)
NetR47_1: 8-8CONRTOL (R47.1), 8-8main (U1.59)
NetR120_1: 8-8CONRTOL (R120.1), 8-8main (U1.61)